# Altium schematic sheet MCU.SchDoc
size A4; SheetNumber: 3; SheetTotal: 6
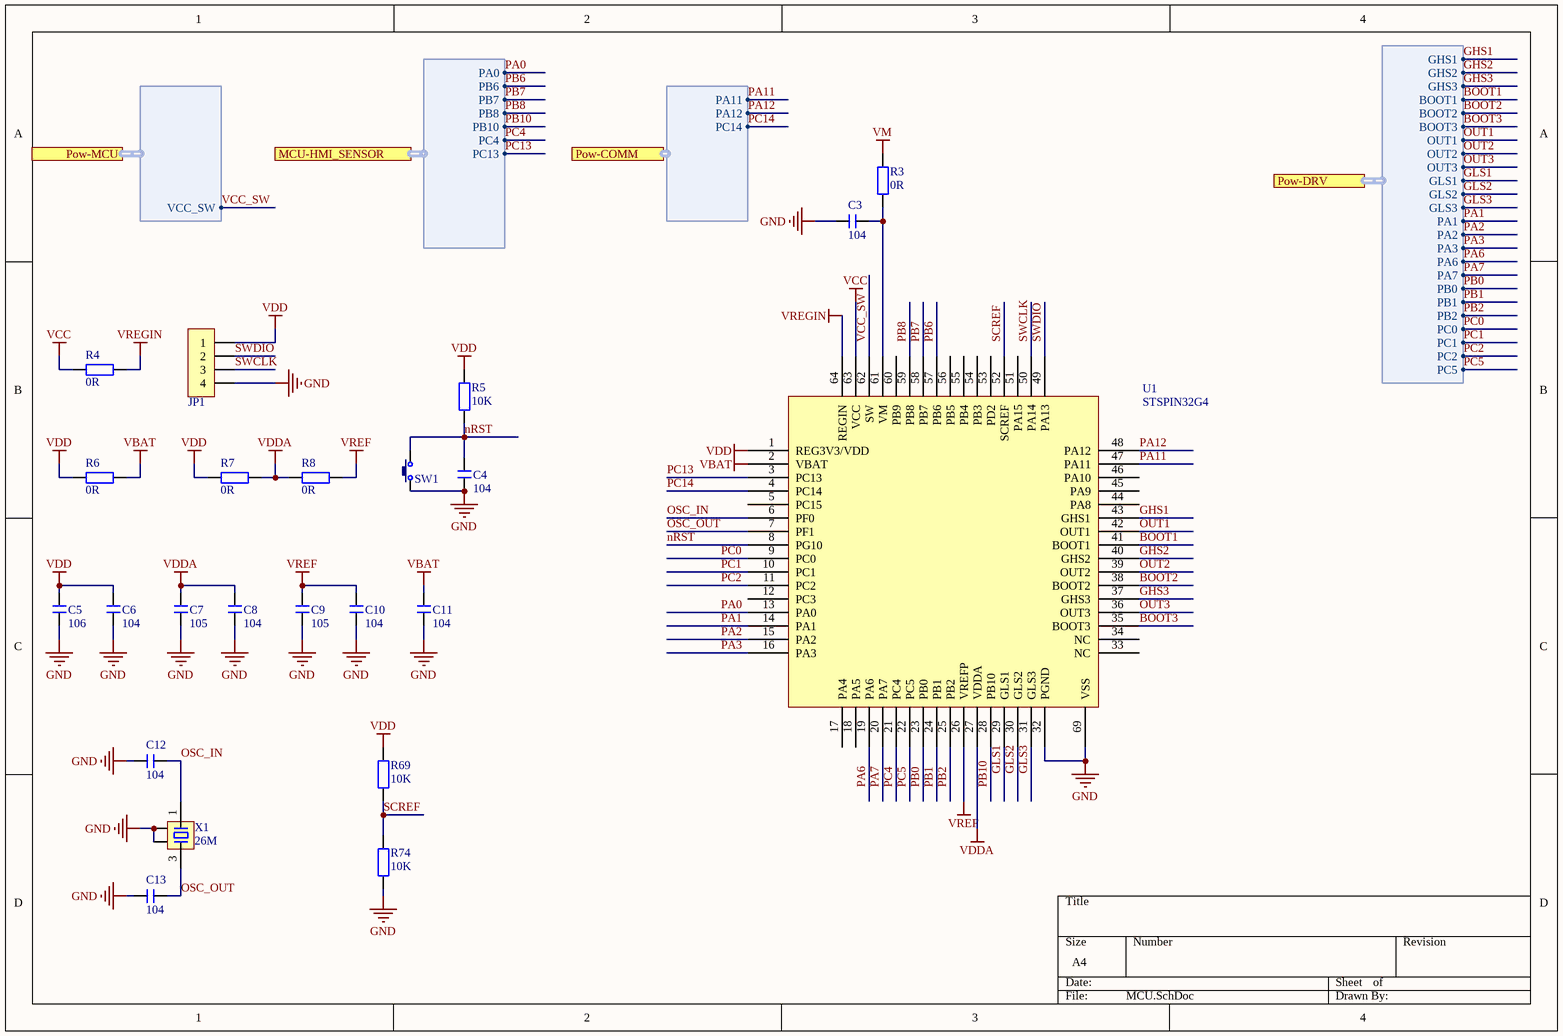
[diagram p0: MCU.SchDoc]

## Parts
C3  104  [C 0603_L]
C4  104  [C 0603_L]
C5  106  [C 0805_L]
C6  104  [C 0603_L]
C7  105  [C 0603_L]
C8  104  [C 0603_L]
C9  105  [C 0603_L]
C10  104  [C 0603_L]
C11  104  [C 0603_L]
C12  104  [C 0603_L]
C13  104  [C 0603_L]
JP1  HDR-1X4  [HDR2.54-LI-4P]  (value not drawn)
R3  0R  [R 0805_L]
R4  0R  [R 0603_L]
R5  10K  [R 0603_L]
R6  0R  [R 0603_L]
R7  0R  [R 0603_L]
R8  0R  [R 0603_L]
R69  10K  [R 0603_L]
R74  10K  [R 0603_L]
SW1  3x6x5  [TSW SMD-3*6*2.5]  (value not drawn)
U1  STSPIN32G4  [QFN64 9x9_L]
X1  26M  [OSC 3225-4P]

## Ports
MCU-HMI_SENSOR (harness Pow-HMI_SENSOR, see TopLevel[2B], HMI_SENSOR[1A]), Pow-COMM (harness Pow-COMM, see TopLevel[2B], COMM[1A]), Pow-DRV (harness Pow-DRV, see TopLevel[2A], DRV[1A]), Pow-MCU (harness Pow-MCU, see TopLevel[2B], POW[1A])

## Harnesses
Pow-MCU: VCC_SW
Pow-DRV: GHS1, GHS2, GHS3, BOOT1, BOOT2, BOOT3, OUT1, OUT2, OUT3, GLS1, GLS2, GLS3, PA1, PA2, PA3, PA6, PA7, PB0, PB1, PB2, PC5, PC0, PC1, PC2
Pow-HMI_SENSOR: PA0, PB6, PB7, PB8, PB10, PC4, PC13
Pow-COMM: PA11, PA12, PC14

## Nets
GND: C3.1 C4.1 C5.1 C6.1 C7.1 C8.1 C9.1 C10.1 C11.1 C12.2 C13.2 JP1.4 R74.1 SW1.1 U1.32(PGND) U1.69(VSS) X1.2 X1.4
VBAT: C11.2 R6.1 U1.2(VBAT)
VCC: R4.2 U1.63(VCC)
VDD: C5.2 C6.2 JP1.1 R5.2 R6.2 R7.2 R69.2 U1.1(REG3V3/VDD)
VDDA: C7.2 C8.2 R7.1 R8.2 U1.27(VDDA)
VM: R3.2
VREF: C9.2 C10.2 R8.1 U1.26(VREFP)
VREGIN: R4.1 U1.64(REGIN)
BOOT1: U1.41(BOOT1) ; port Pow-DRV.BOOT1
BOOT2: U1.38(BOOT2) ; port Pow-DRV.BOOT2
BOOT3: U1.35(BOOT3) ; port Pow-DRV.BOOT3
GHS1: U1.43(GHS1) ; port Pow-DRV.GHS1
GHS2: U1.40(GHS2) ; port Pow-DRV.GHS2
GHS3: U1.37(GHS3) ; port Pow-DRV.GHS3
GLS1: U1.29(GLS1) ; port Pow-DRV.GLS1
GLS2: U1.30(GLS2) ; port Pow-DRV.GLS2
GLS3: U1.31(GLS3) ; port Pow-DRV.GLS3
nRST: C4.2 R5.1 SW1.2 U1.8(PG10)
OSC_IN: C12.1 U1.6(PF0) X1.1
OSC_OUT: C13.1 U1.7(PF1) X1.3
OUT1: U1.42(OUT1) ; port Pow-DRV.OUT1
OUT2: U1.39(OUT2) ; port Pow-DRV.OUT2
OUT3: U1.36(OUT3) ; port Pow-DRV.OUT3
PA0: U1.13(PA0) ; port MCU-HMI_SENSOR.PA0
PA1: U1.14(PA1) ; port Pow-DRV.PA1
PA2: U1.15(PA2) ; port Pow-DRV.PA2
PA3: U1.16(PA3) ; port Pow-DRV.PA3
PA6: U1.19(PA6) ; port Pow-DRV.PA6
PA7: U1.20(PA7) ; port Pow-DRV.PA7
PA11: U1.47(PA11) ; port Pow-COMM.PA11
PA12: U1.48(PA12) ; port Pow-COMM.PA12
PB0: U1.23(PB0) ; port Pow-DRV.PB0
PB1: U1.24(PB1) ; port Pow-DRV.PB1
PB2: U1.25(PB2) ; port Pow-DRV.PB2
PB6: U1.57(PB6) ; port MCU-HMI_SENSOR.PB6
PB7: U1.58(PB7) ; port MCU-HMI_SENSOR.PB7
PB8: U1.59(PB8) ; port MCU-HMI_SENSOR.PB8
PB10: U1.28(PB10) ; port MCU-HMI_SENSOR.PB10
PC0: U1.9(PC0) ; port Pow-DRV.PC0
PC1: U1.10(PC1) ; port Pow-DRV.PC1
PC2: U1.11(PC2) ; port Pow-DRV.PC2
PC4: U1.21(PC4) ; port MCU-HMI_SENSOR.PC4
PC5: U1.22(PC5) ; port Pow-DRV.PC5
PC13: U1.3(PC13) ; port MCU-HMI_SENSOR.PC13
PC14: U1.4(PC14) ; port Pow-COMM.PC14
SCREF: R69.1 R74.2 U1.52(SCREF)
SWCLK: JP1.3 U1.50(PA14)
SWDIO: JP1.2 U1.49(PA13)
VCC_SW: U1.62(SW) ; port Pow-MCU.VCC_SW
NetC3_2: C3.2 R3.1 U1.61(VM)

Not connected (* = marked no-connect by the designer): U1 5(PC15) 12(PC3) 17(PA4) 18(PA5) 33(NC) 34(NC) 44(PA8) 45(PA9) 46(PA10) 51(PA15) 53(PD2) 54(PB3) 55(PB4) 56(PB5) 60(PB9)

## Library data of the parts
C3-C13 = C: 无极性贴片电容; 版权归属: 源创客; BOM名称: 无极性贴片电容; 学习资源: www.ooocke.com
JP1 = Header 4: 4P接插件; 版权归属: 源创客; BOM名称: 4P接插件; 学习资源: www.ooocke.com
R3-R8 R69 R74 = R: 贴片电阻; 版权归属: 源创客; BOM名称: 贴片电阻; 学习资源: www.ooocke.com
SW1 = TSW 3x6: 3x6轻触开关; 版权归属: 源创客; BOM名称: 3x6轻触开关; 学习资源: www.ooocke.com
X1 = XTAL-4P: 4脚无源晶振; 版权归属: 源创客; BOM名称: 4脚无源晶振; 学习资源: www.ooocke.com